# EAGLE design mLRS-tx-dualE22-top-v042 (EAGLE 7.5.0)
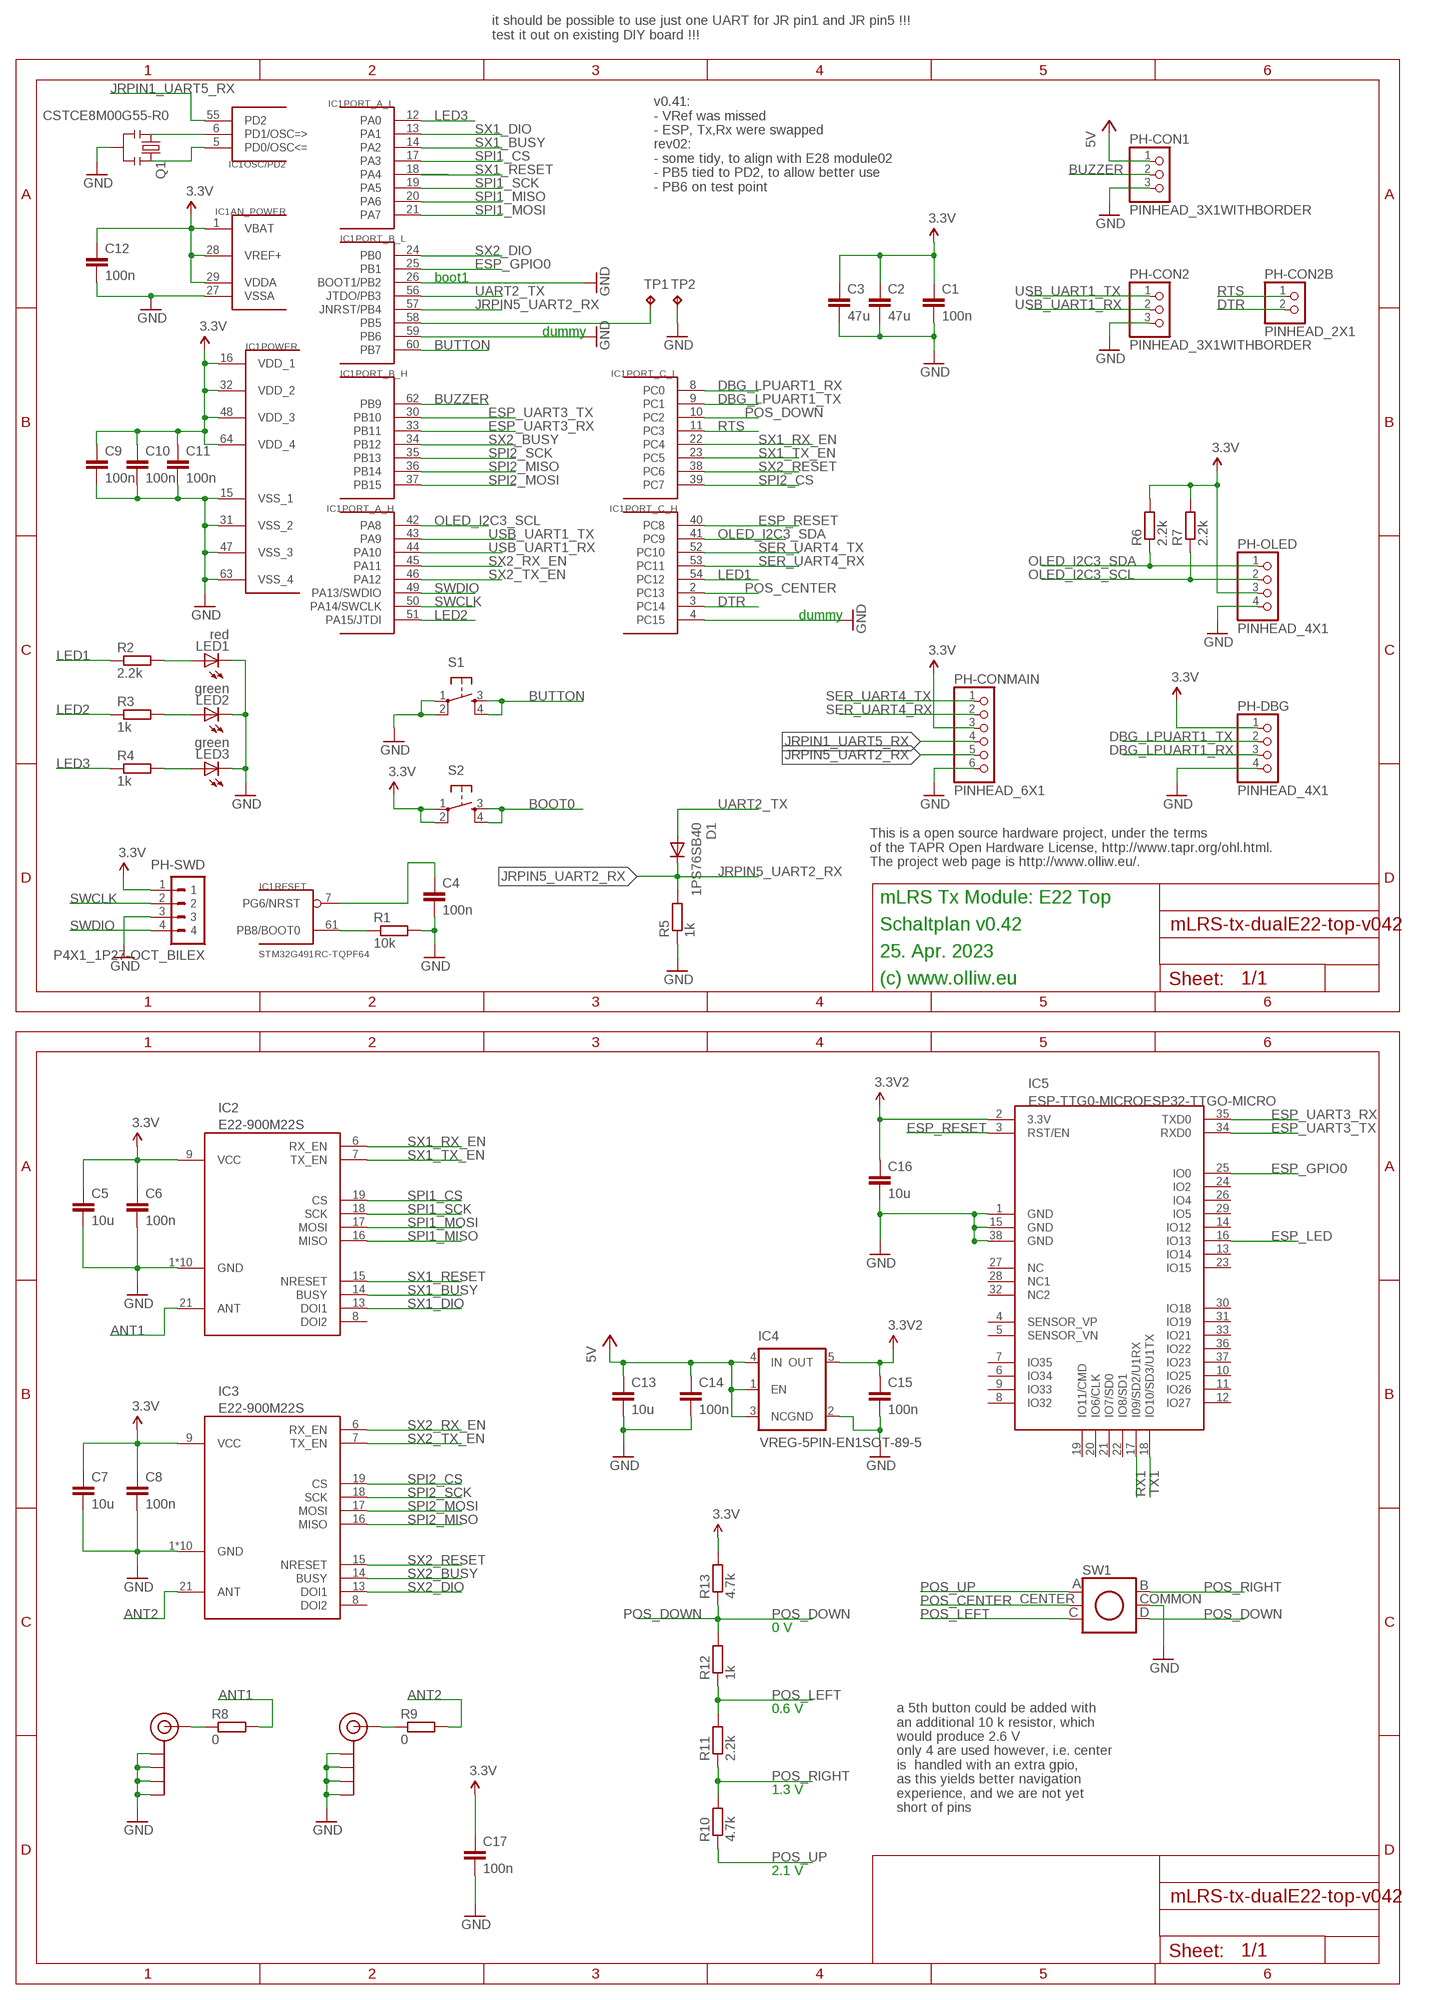
[diagram p0: schematic, sheet 1]

## Parts
C1  100n  C-EUC0402  [C0402]
C2  47u  C-EUC1210  [C1210]
C3  47u  C-EUC1206K  [C1206K]
C4  100n  C-EUC0402  [C0402]
C5  10u  C-EUC0603  [C0603]
C6  100n  C-EUC0402  [C0402]
C7  10u  C-EUC0603  [C0603]
C8  100n  C-EUC0402  [C0402]
C9  100n  C-EUC0402  [C0402]
C10  100n  C-EUC0402  [C0402]
C11  100n  C-EUC0402  [C0402]
C12  100n  C-EUC0402  [C0402]
C13  10u  C-EUC0603  [C0603]
C14  100n  C-EUC0402  [C0402]
C15  100n  C-EUC0402  [C0402]
C16  10u  C-EUC0603  [C0603]
C17  100n  C-EUC0402  [C0402]
D1  1PS76SB40  DIODE-SOD110-R  [SOD110-R]
IC1  STM32G491RC-TQPF64  STM32G4X1RX-TQPF64  [TQFP64]
IC2  E22-900M22S  [E22-900M22S]
IC3  E22-900M22S  [E22-900M22S]
IC4  VREG-5PIN-EN1SOT-89-5  [SOT-89-5]
IC5  ESP-TTG0-MICROESP32-TTGO-MICRO  [ESP32-TTGO-MICRO]
LED1  red  LEDCHIPLED_0603  [CHIPLED_0603]
LED2  green  LEDCHIPLED_0603  [CHIPLED_0603]
LED3  green  LEDCHIPLED_0603  [CHIPLED_0603]
PH-CON1  PINHEAD_3X1WITHBORDER  [PINHEAD_3X1]
PH-CON2  PINHEAD_3X1WITHBORDER  [PINHEAD_3X1]
PH-CON2B  PINHEAD_2X1  [PINHEAD_2X1]
PH-CONMAIN  PINHEAD_6X1  [PINHEAD_6X1]
PH-DBG  PINHEAD_4X1  [PINHEAD_4X1]
PH-OLED  PINHEAD_4X1  [PINHEAD_4X1]
PH-SWD  P4X1_1P27-OCT_BILEX  [4X1_1P27_OCT_BILEX]
Q1  CSTCE8M00G55-R0  RESONATORSMD  [RESONATOR-SMD]
R1  10k  R-EU_R0402  [R0402]
R2  2.2k  R-EU_R0402  [R0402]
R3  1k  R-EU_R0402  [R0402]
R4  1k  R-EU_R0402  [R0402]
R5  1k  R-EU_R0402  [R0402]
R6  2.2k  R-EU_R0402  [R0402]
R7  2.2k  R-EU_R0402  [R0402]
R8  0  R-EU_R0402  [R0402]
R9  0  R-EU_R0402  [R0402]
R10  4.7k  R-EU_R0402  [R0402]
R11  2.2k  R-EU_R0402  [R0402]
R12  1k  R-EU_R0402  [R0402]
R13  4.7k  R-EU_R0402  [R0402]
RF1  SMA_EDGE  [SMA-EDGE]
RF2  SMA_EDGE  [SMA-EDGE]
S1  TAC_SWITCHPTH  [TACTILE-PTH]
S2  TAC_SWITCHPTH  [TACTILE-PTH]
SW1  JOYSTICK-5WAY  [JOYSTICK-5WAY]
TP1  TPB1,27  [B1,27]
TP2  TPB1,27  [B1,27]

## Nets
2.8V: C15.1 C16.1 IC4.5(OUT) IC5.2(3.3V) ; supply symbol labelled 3.3V2
3.3V: C1.1 C2.1 C3.1 C5.1 C6.1 C7.1 C8.1 C9.1 C10.1 C11.1 C12.1 C17.1 IC1.1(AN_POWER:VBAT) IC1.16(POWER:VDD_1) IC1.28(AN_POWER:VREF+) IC1.29(AN_POWER:VDDA) IC1.32(POWER:VDD_2) IC1.48(POWER:VDD_3) IC1.64(POWER:VDD_4) IC2.9(VCC) IC3.9(VCC) PH-CONMAIN.3 PH-DBG.1 PH-OLED.3 PH-SWD.1 R6.2 R7.2 R13.2 S2.1 S2.2
5V: C13.1 C14.1 IC4.1(EN) IC4.3(NC) IC4.4(IN) PH-CON1.1
ANT1: IC2.21(ANT) R8.2
ANT2: IC3.21(ANT) R9.2
BOOT0: IC1.61(RESET:PB8/BOOT0) R1.1 S2.3 S2.4
BUTTON: IC1.60(PORT_B_L:PB7) S1.3 S1.4
BUZZER: IC1.62(PORT_B_H:PB9) PH-CON1.2
DBG_LPUART1_RX: IC1.8(PORT_C_L:PC0) PH-DBG.3
DBG_LPUART1_TX: IC1.9(PORT_C_L:PC1) PH-DBG.2
DTR: IC1.3(PORT_C_H:PC14) PH-CON2B.2
ESP_GPIO0: IC1.25(PORT_B_L:PB1) IC5.25(IO0)
ESP_LED: IC5.16(IO13)
ESP_RESET: IC1.40(PORT_C_H:PC8) IC5.3(RST/EN)
ESP_UART3_RX: IC1.33(PORT_B_H:PB11) IC5.35(TXD0)
ESP_UART3_TX: IC1.30(PORT_B_H:PB10) IC5.34(RXD0)
GND: C1.2 C2.2 C3.2 C4.2 C5.2 C6.2 C7.2 C8.2 C9.2 C10.2 C11.2 C12.2 C13.2 C14.2 C15.2 C16.2 C17.2 IC1.4(PORT_C_H:PC15) IC1.15(POWER:VSS_1) IC1.26(PORT_B_L:BOOT1/PB2) IC1.27(AN_POWER:VSSA) IC1.31(POWER:VSS_2) IC1.47(POWER:VSS_3) IC1.59(PORT_B_L:PB6) IC1.63(POWER:VSS_4) IC2.1(GND) IC2.2(GND) IC2.3(GND) IC2.4(GND) IC2.5(GND) IC2.10(GND) IC2.11(GND) IC2.12(GND) IC2.20(GND) IC2.22(GND) IC3.1(GND) IC3.2(GND) IC3.3(GND) IC3.4(GND) IC3.5(GND) IC3.10(GND) IC3.11(GND) IC3.12(GND) IC3.20(GND) IC3.22(GND) IC4.2(GND) IC5.1(GND) IC5.15(GND) IC5.38(GND) LED1.C LED2.C LED3.C PH-CON1.3 PH-CON2.3 PH-CONMAIN.6 PH-DBG.4 PH-OLED.4 PH-SWD.3 Q1.2 R1.2 R5.1 RF1.GND@0(GND) RF1.GND@1(GND) RF1.GND@2(GND) RF1.GND@3(GND) RF2.GND@0(GND) RF2.GND@1(GND) RF2.GND@2(GND) RF2.GND@3(GND) S1.1 S1.2 SW1.5(COMMON) TP2.TP
JRPIN1_UART5_RX: IC1.55(OSC/PD2:PD2) PH-CONMAIN.4
JRPIN5_UART2_RX: D1.C IC1.57(PORT_B_L:JNRST/PB4) PH-CONMAIN.5 R5.2
LED1: IC1.54(PORT_C_H:PC12) R2.1
LED2: IC1.51(PORT_A_H:PA15/JTDI) R3.1
LED3: IC1.12(PORT_A_L:PA0) R4.1
N$1: R8.1 RF1.SIG(SIGNAL)
N$2: R9.1 RF2.SIG(SIGNAL)
N$3: IC1.58(PORT_B_L:PB5) TP1.TP
N$4: LED1.A R2.2
N$5: C4.1 IC1.7(RESET:PG6/NRST)
N$8: LED2.A R3.2
N$9: LED3.A R4.2
N$12: IC1.5(OSC/PD2:PD0/OSC<=) Q1.3
N$14: IC1.6(OSC/PD2:PD1/OSC=>) Q1.1
OLED_I2C3_SCL: IC1.42(PORT_A_H:PA8) PH-OLED.2 R7.1
OLED_I2C3_SDA: IC1.41(PORT_C_H:PC9) PH-OLED.1 R6.1
POS_CENTER: IC1.2(PORT_C_H:PC13) SW1.2(CENTER)
POS_DOWN: IC1.10(PORT_C_L:PC2) R12.2 R13.1 SW1.6(D)
POS_LEFT: R11.2 R12.1 SW1.3(C)
POS_RIGHT: R10.2 R11.1 SW1.4(B)
POS_UP: R10.1 SW1.1(A)
RTS: IC1.11(PORT_C_L:PC3) PH-CON2B.1
RX1: IC5.17(I09/SD2/U1RX)
SER_UART4_RX: IC1.53(PORT_C_H:PC11) PH-CONMAIN.2
SER_UART4_TX: IC1.52(PORT_C_H:PC10) PH-CONMAIN.1
SPI1_CS: IC1.17(PORT_A_L:PA3) IC2.19(CS)
SPI1_MISO: IC1.20(PORT_A_L:PA6) IC2.16(MISO)
SPI1_MOSI: IC1.21(PORT_A_L:PA7) IC2.17(MOSI)
SPI1_SCK: IC1.19(PORT_A_L:PA5) IC2.18(SCK)
SPI2_CS: IC1.39(PORT_C_L:PC7) IC3.19(CS)
SPI2_MISO: IC1.36(PORT_B_H:PB14) IC3.16(MISO)
SPI2_MOSI: IC1.37(PORT_B_H:PB15) IC3.17(MOSI)
SPI2_SCK: IC1.35(PORT_B_H:PB13) IC3.18(SCK)
SWCLK: IC1.50(PORT_A_H:PA14/SWCLK) PH-SWD.2
SWDIO: IC1.49(PORT_A_H:PA13/SWDIO) PH-SWD.4
SX1_BUSY: IC1.14(PORT_A_L:PA2) IC2.14(BUSY)
SX1_DIO: IC1.13(PORT_A_L:PA1) IC2.13(DOI1)
SX1_RESET: IC1.18(PORT_A_L:PA4) IC2.15(NRESET)
SX1_RX_EN: IC1.22(PORT_C_L:PC4) IC2.6(RX_EN)
SX1_TX_EN: IC1.23(PORT_C_L:PC5) IC2.7(TX_EN)
SX2_BUSY: IC1.34(PORT_B_H:PB12) IC3.14(BUSY)
SX2_DIO: IC1.24(PORT_B_L:PB0) IC3.13(DOI1)
SX2_RESET: IC1.38(PORT_C_L:PC6) IC3.15(NRESET)
SX2_RX_EN: IC1.45(PORT_A_H:PA11) IC3.6(RX_EN)
SX2_TX_EN: IC1.46(PORT_A_H:PA12) IC3.7(TX_EN)
TX1: IC5.18(IO10/SD3/U1TX)
UART2_TX: D1.A IC1.56(PORT_B_L:JTDO/PB3)
USB_UART1_RX: IC1.44(PORT_A_H:PA10) PH-CON2.2
USB_UART1_TX: IC1.43(PORT_A_H:PA9) PH-CON2.1
Unconnected: IC2.8(DOI2) IC3.8(DOI2) IC5.4(SENSOR_VP) IC5.5(SENSOR_VN) IC5.6(IO34) IC5.7(IO35) IC5.8(IO32) IC5.9(IO33) IC5.10(IO25) IC5.11(IO26) IC5.12(IO27) IC5.13(IO14) IC5.14(IO12) IC5.19(IO11/CMD) IC5.20(IO6/CLK) IC5.21(IO7/SD0) IC5.22(IO8/SD1) IC5.23(IO15) IC5.24(IO2) IC5.26(IO4) IC5.27(NC) IC5.28(NC1) IC5.29(IO5) IC5.30(IO18) IC5.31(IO19) IC5.32(NC2) IC5.33(IO21) IC5.36(IO22) IC5.37(IO23)

## Notes on the sheet
- it should be possible to use just one UART for JR pin1 and JR pin5 !!!
  test it out on existing DIY board !!!
- v0.41:
  - VRef was missed
  - ESP, Tx,Rx were swapped
  rev02:
  - some tidy, to align with E28 module02
  - PB5 tied to PD2, to allow better use
  - PB6 on test point
- boot1
- dummy
- dummy
- This is a open source hardware project, under the terms
  of the TAPR Open Hardware License, http://www.tapr.org/ohl.html.
  The project web page is http://www.olliw.eu/.
- mLRS Tx Module: E22 Top
- Schaltplan v0.42
- 25. Apr. 2023
- (c) www.olliw.eu
- 0 V
- a 5th button could be added with
  an additional 10 k resistor, which
  would produce 2.6 V
  only 4 are used however, i.e. center
  is  handled with an extra gpio,
  as this yields better navigation
  experience, and we are not yet
  short of pins
- 0.6 V
- 1.3 V
- 2.1 V

## Library data of the parts
C1-C17 = rcl:C-EU: CAPACITOR, European symbol
D1 = diode:DIODE-: DIODE
IC1 = # stm32:STM32G4X1RX
IC2 IC3 = # stdlib:E22-900M22S
IC4 = # stdlib:VREG-5PIN-EN1
IC5 = # stdlib:ESP-TTG0-MICRO
LED1-LED3 = led:LED: LED OSRAM: - CHIPLED LG R971, LG N971, LY N971, LG Q971, LY Q971, LO R971, LY R971 LH N974, LH R974 LS Q976, LO Q976, LY Q976 LO Q996 - Hyper CHIPLED LW Q18S LB Q993, LB Q99A, LB R99A - SideLED LS A670, LO A670, LY A670, LG A670, LP A670 LB A673, LV A673, LT A673, LW A673 LH A674 LY A675 LS A676, LA A676, LO A676, LY A676, LW A676 LS A679, LY A679, LG A679 - Hyper Micro SIDELED® LS Y876, LA Y876, LO Y876, LY Y876 LT Y87S - SmartLED LW L88C, LW L88S LB L89C, LB L89S, LG L890 LS L89K, LO L89K, LY L89K LS L896, LA L896, LO L896, LY L896 - TOPLED LS T670, LO T670, LY T670, LG T670, LP T670 LSG T670, LSP T670, LSY T670, LOP T670, LYG T670 LG T671, LOG T671, LSG T671 LB T673, LV T673, LT T673, LW T673 LH T674 LS T676, LA T676, LO T676, LY T676, LB T676, LH T676, LSB T676, LW T676 LB T67C, LV T67C, LT T67C, LS T67K, LO T67K, LY T67K, LW E67C LS E67B, LA E67B, LO E67B, LY E67B, LB E67C, LV E67C, LT E67C LW T67C LS T679, LY T679, LG T679 LS T770, LO T770, LY T770, LG T770, LP T770 LB T773, LV T773, LT T773, LW T773 LH T774 LS E675, LA E675, LY E675, LS T675 LS T776, LA T776, LO T776, LY T776, LB T776 LHGB T686 LT T68C, LB T68C - Hyper Mini TOPLED® LB M676 - Mini TOPLED Santana® LG M470 LS M47K, LO M47K, LY M47K Source: http://www.osram.convergy.de LUXEON: - LUMILED® LXK2-PW12-R00, LXK2-PW12-S00, LXK2-PW14-U00, LXK2-PW14-V00 LXK2-PM12-R00, LXK2-PM12-S00, LXK2-PM14-U00 LXK2-PE12-Q00, LXK2-PE12-R00, LXK2-PE12-S00, LXK2-PE14-T00, LXK2-PE14-U00 LXK2-PB12-K00, LXK2-PB12-L00, LXK2-PB12-M00, LXK2-PB14-N00, LXK2-PB14-P00, LXK2-PB14-Q00 LXK2-PR12-L00, LXK2-PR12-M00, LXK2-PR14-Q00, LXK2-PR14-R00 LXK2-PD12-Q00, LXK2-PD12-R00, LXK2-PD12-S00 LXK2-PH12-R00, LXK2-PH12-S00 LXK2-PL12-P00, LXK2-PL12-Q00, LXK2-PL12-R00 Source: www.luxeon.com KINGBRIGHT: KA-3528ASYC Source: www.kingbright.com
PH-CON1 PH-CON2 = # stdlib:PINHEAD_3X1
PH-CON2B = # stdlib:PINHEAD_2X1
PH-CONMAIN = # stdlib:PINHEAD_6X1
PH-DBG PH-OLED = # stdlib:PINHEAD_4X1
PH-SWD = # stdlib:P4X1_1P27
Q1 = # SparkFun2:RESONATOR: Resonator Small SMD resonator. This is the itty bitty 10/20MHz resonators with built in caps. CSTCE10M0G55 and CSTCE20M0V53. Footprint has been reviewed closely but hasn't been tested yet.
R1-R13 = rcl:R-EU_: RESISTOR, European symbol
RF1 RF2 = # SparkFun2:SMA_EDGE: SMA Antenna Connector End launch SMA connector. The paste layer has been removed so that the connector can be hand soldered onto the board after reflow.
S1 S2 = # SparkFun2:TAC_SWITCH: Momentary Switch Button commonly used for reset or general input. Spark Fun Electronics SKU : COM-00097
SW1 = # stdlib:JOYSTICK-5WAY
TP1 TP2 = testpad:TP: Test pad

## Board
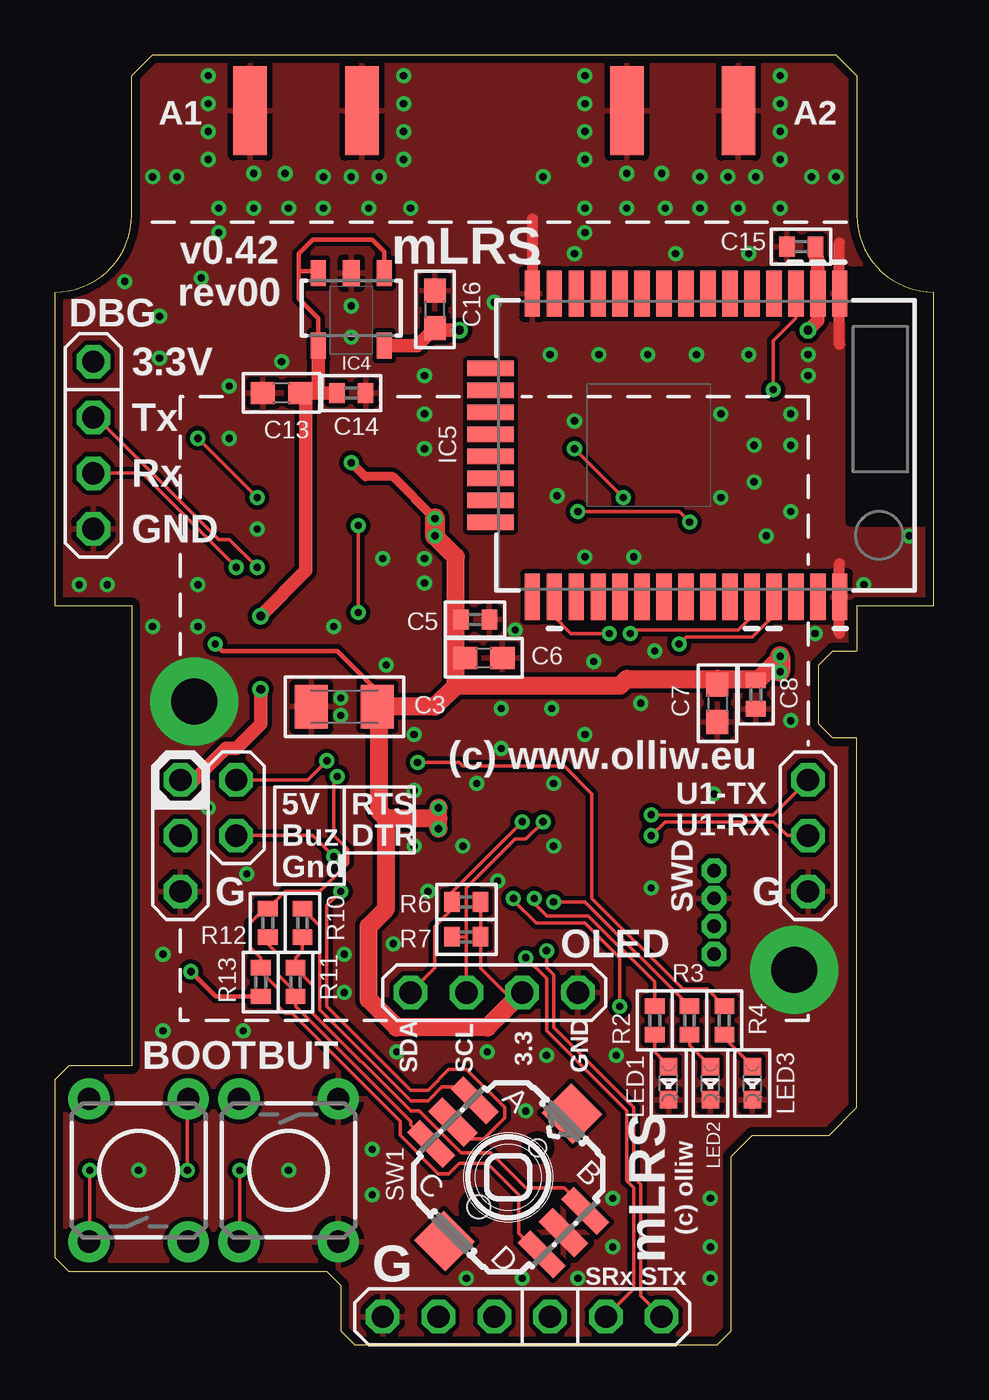
[diagram p1: board, top side]
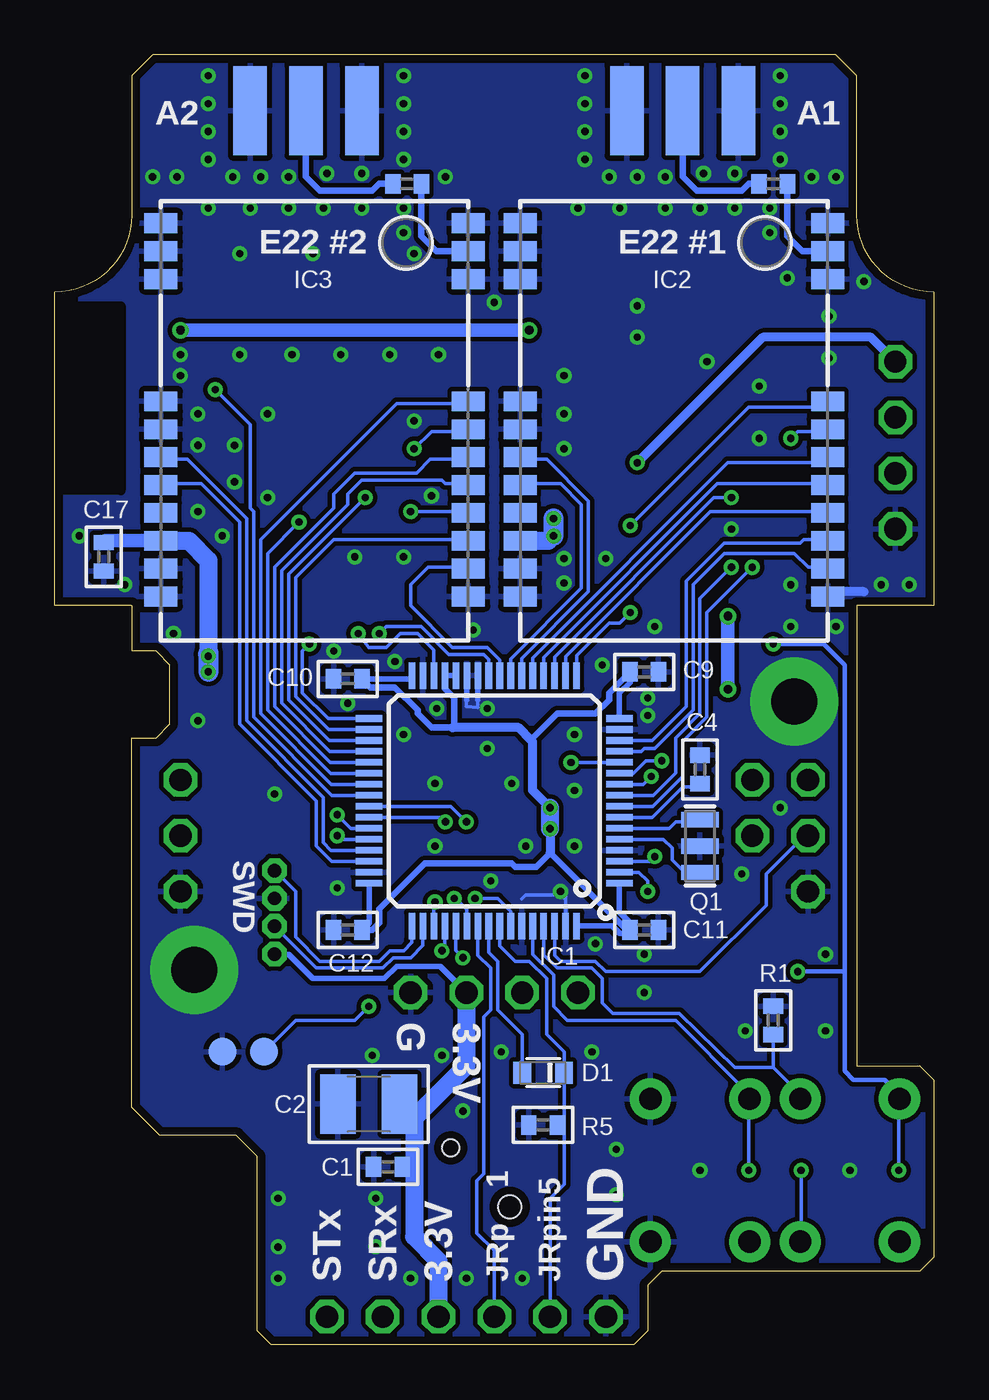
[diagram p2: board, bottom side, seen from below]

Size 40.01 x 58.74 mm. Coordinates in mm from the lower left corner, seen from the top.
Outline: 36.51,10.79 36.51,27.62 35.4,27.62 34.77,28.26 34.77,30.96 35.4,31.59 36.51,31.59 36.51,33.66 40.01,33.66 40.01,47.94 arc-90 36.51,51.44 36.51,57.78 35.56,58.74 4.45,58.74 3.49,57.78 3.49,51.44 arc-90 0,47.94 0,33.66 3.49,33.66 3.49,12.7 0.64,12.7 0,12.07 0,3.97 0.64,3.33 12.38,3.33 13.02,2.7 13.02,0.63 13.65,0 30.16,0 30.8,0.63 30.8,8.57 31.75,9.53 35.24,9.53 36.51,10.79
Copper layers (1*16): Top 0.0356mm / dielectric 1.5011mm / Bottom 0.0356mm
Design rules "ow-oshpark-2layer": minimum track width 6mil, minimum drill 13mil, track to track 6mil, track to pad 6mil, pad to pad 6mil, via to via 6mil, smd to smd 6mil, copper to edge 15mil, drill to drill 6mil, minimum pad ring 7mil, minimum via ring 7mil, stop-mask expansion 2.5mil, vias tented up to drill 26mil, thermal gap 10mil
tRestrict: area 36.2,37.5 to 40.6,48.9
bRestrict: area 37,38.9 to 40.6,47.3

### Footprints (pad centres in the part's own frame; a part is rotated, then mirrored left to right if it is on the bottom)
C0402 = smd 0.7 x 0.9: 1 -0.65,0; 2 0.65,0
C1210 = smd 1.6 x 2.7: 1 -1.4,0; 2 1.4,0
C1206K = smd 1.5 x 2: 1 -1.5,0; 2 1.5,0
C0603 = smd 1.1 x 1: 1 -0.85,0; 2 0.85,0
SOD110-R = smd 0.8 x 1: A 0.95,0; C -0.95,0
TQFP64 = smd 1.2 x 0.3: 1 -5.7,3.75; 2 -5.7,3.25; 3 -5.7,2.75; 4 -5.7,2.25; 5 -5.7,1.75; 6 -5.7,1.25; 7 -5.7,0.75; 8 -5.7,0.25; 9 -5.7,-0.25; 10 -5.7,-0.75; 11 -5.7,-1.25; 12 -5.7,-1.75; 13 -5.7,-2.25; 14 -5.7,-2.75; 15 -5.7,-3.25; 16 -5.7,-3.75; 33 5.7,-3.75; 34 5.7,-3.25; 35 5.7,-2.75; 36 5.7,-2.25; 37 5.7,-1.75; 38 5.7,-1.25; 39 5.7,-0.75; 40 5.7,-0.25; 41 5.7,0.25; 42 5.7,0.75; 43 5.7,1.25; 44 5.7,1.75; 45 5.7,2.25; 46 5.7,2.75; 47 5.7,3.25; 48 5.7,3.75 | smd 0.3 x 1.2: 17 -3.75,-5.7; 18 -3.25,-5.7; 19 -2.75,-5.7; 20 -2.25,-5.7; 21 -1.75,-5.7; 22 -1.25,-5.7; 23 -0.75,-5.7; 24 -0.25,-5.7; 25 0.25,-5.7; 26 0.75,-5.7; 27 1.25,-5.7; 28 1.75,-5.7; 29 2.25,-5.7; 30 2.75,-5.7; 31 3.25,-5.7; 32 3.75,-5.7; 49 3.75,5.7; 50 3.25,5.7; 51 2.75,5.7; 52 2.25,5.7; 53 1.75,5.7; 54 1.25,5.7; 55 0.75,5.7; 56 0.25,5.7; 57 -0.25,5.7; 58 -0.75,5.7; 59 -1.25,5.7; 60 -1.75,5.7; 61 -2.25,5.7; 62 -2.75,5.7; 63 -3.25,5.7; 64 -3.75,5.7
E22-900M22S = smd 1.5 x 0.9: 1 -7,9; 2 -7,7.73; 3 -7,6.46; 4 -7,0.89; 5 -7,-0.38; 6 -7,-1.65; 7 -7,-2.92; 8 -7,-4.19; 9 -7,-5.46; 10 -7,-6.73; 11 -7,-8; 12 7,-8; 13 7,-6.73; 14 7,-5.46; 15 7,-4.19; 16 7,-2.92; 17 7,-1.65; 18 7,-0.38; 19 7,0.89; 20 7,6.46; 21 7,7.73; 22 7,9
SOT-89-5 = smd 0.68 x 1.2: 1 -1.5,-1.65; 3 1.5,-1.65; 4 1.5,1.65; 5 -1.5,1.65 | smd 0.76 x 1.2: 2 0,-1.65
ESP32-TTGO-MICRO = smd 2.1 x 0.7: 1 -6.9,7; 2 -6.9,6; 3 -6.9,5; 4 -6.9,4; 5 -6.9,3; 6 -6.9,2; 7 -6.9,1; 8 -6.9,0; 9 -6.9,-1; 10 -6.9,-2; 11 -6.9,-3; 12 -6.9,-4; 13 -6.9,-5; 14 -6.9,-6; 15 -6.9,-7; 24 6.9,-7; 25 6.9,-6; 26 6.9,-5; 27 6.9,-4; 28 6.9,-3; 29 6.9,-2; 30 6.9,-1; 31 6.9,0; 32 6.9,1; 33 6.9,2; 34 6.9,3; 35 6.9,4; 36 6.9,5; 37 6.9,6; 38 6.9,7 | smd 0.7 x 2.1: 16 -3.5,-8.9; 17 -2.5,-8.9; 18 -1.5,-8.9; 19 -0.5,-8.9; 20 0.5,-8.9; 21 1.5,-8.9; 22 2.5,-8.9; 23 3.5,-8.9
CHIPLED_0603 = smd 0.8 x 0.8: A 0,-0.75; C 0,0.75
PINHEAD_3X1 = drill 1.016 octagon: 1 0,0; 2 0,-2.54; 3 0,-5.08
PINHEAD_2X1 = drill 1.016 octagon: 1 0,0; 2 0,-2.54
PINHEAD_6X1 = drill 1.016 octagon: 1 0,12.7; 2 0,10.16; 3 0,7.62; 4 0,5.08; 5 0,2.54; 6 0,0
PINHEAD_4X1 = drill 1.016 octagon: 1 0,7.62; 2 0,5.08; 3 0,2.54; 4 0,0
4X1_1P27_OCT_BILEX = drill 0.61 pad 1.118 octagon: 1 0,0; 2 0,-1.27; 3 0,-2.54; 4 0,-3.81
RESONATOR-SMD = smd 0.7 x 1.7: 1 -1.2,0; 2 0,0; 3 1.2,0
R0402 = smd 0.7 x 0.9: 1 -0.65,0; 2 0.65,0
SMA-EDGE = smd 1.524 x 4.064: GND@0 0,0; GND@1 5.08,0; SIG 2.54,0 | smd 1.524 x 4.064 bottom: GND@2 0,0; GND@3 5.08,0
TACTILE-PTH = drill 1.016 pad 1.88: 1 -3.251,2.261; 2 3.251,2.261; 3 -3.251,-2.261; 4 3.251,-2.261
JOYSTICK-5WAY = smd 2.286 x 0.813: 1 -3.556,1.4; 3 -3.556,-1.4; 4 3.556,1.4; 6 3.556,-1.4 | smd 2.286 x 0.914: 2 -3.556,0; 5 3.556,0 | smd 2 x 1.9: S 0,4.1; T 0,-4.1 | hole 0.75: 0,1.9 | hole 1.05: 0,-1.9
B1,27 = smd 1.27 x 1.27: TP 0,0

### Placement (x,y rotation side)
C1  24.84,8.1 180 bottom
C2  25.72,10.95 180 bottom
C3  13.18,29.05 180 top
C4  10.64,26.19 90 bottom
C5  19.53,31.27 0 top
C6  19.13,33.02 0 top
C7  30.16,29.21 270 top
C8  31.91,29.61 270 top
C9  13.18,30.64 0 bottom
C10  26.67,30.32 180 bottom
C11  13.18,18.89 0 bottom
C12  26.67,18.89 180 bottom
C13  10.32,43.34 180 top
C14  13.49,43.34 0 top
C15  33.97,50.01 180 top
C16  17.3,47.15 90 top
C17  37.78,35.88 270 bottom
D1  17.78,12.38 180 bottom
IC1  20,24.77 180 bottom
IC2  11.83,42.07 0 bottom
IC3  28.18,42.07 0 bottom
IC4  13.49,47.15 180 top
IC5  28.73,40.96 270 top
LED1  27.94,11.91 180 top
LED2  29.84,11.91 180 top
LED3  31.75,11.91 180 top
PH-CON1  5.71,25.72 0 top
PH-CON2  34.29,25.72 0 top
PH-CON2B  8.26,25.72 0 top
PH-CONMAIN  14.92,1.27 270 top
PH-DBG  1.75,37.15 0 top
PH-OLED  23.81,16.03 90 top
PH-SWD  30,17.78 180 top
Q1  10.64,22.7 270 bottom
R1  7.3,14.76 90 bottom
R2  27.3,14.76 270 top
R3  28.89,14.76 270 top
R4  30.48,14.76 270 top
R5  17.78,10 0 bottom
R6  18.73,20.16 0 top
R7  18.73,18.57 0 top
R8  7.3,52.86 0 bottom
R9  23.97,52.86 0 bottom
R10  11.27,19.21 270 top
R11  10.95,16.51 270 top
R12  9.68,19.21 90 top
R13  9.37,16.51 270 top
RF1  13.97,56.2 0 bottom
RF2  31.11,56.2 0 bottom
S1  10.64,7.94 270 top
S2  3.81,7.94 90 top
SW1  20.64,7.62 315 top
TP1  30.48,13.34 0 bottom
TP2  32.39,13.34 0 bottom

### Tracks (layer width: path | path; a pad name or v marks a point on that pad's centre or on a via)
2.8V  (via drill 0.4)
  Top 0.61: v34.29,46.2 34.73,46.64 IC5.2 34.73,49.4 34.61,49.53 34.61,50.15 C15.1 | IC4.5 16.5,45.5 C16.1 17.3,46.2 v18.41,46.2
  Bottom 0.61: v34.29,46.2 v18.41,46.2
3.3V  (via drill 0.33)
  Top 0.152: PH-OLED.3 20.48,16.03 19.38,17.13 R7.2 R6.2 | v1.59,7.94 1.59,4.72 S2.1
  Top 0.203: 14.76,29.69 12.86,31.59 7.62,31.59 v7.3,31.91 | R13.2 7.32,15.86 v6.19,16.99
  Top 0.406: 14.76,29.69 14.76,28.26 | v17.3,37.62 15.4,39.53 14.13,39.53 v13.49,40.16
  Top 0.61: C3.1 14.52,28.8 14.76,28.26 | C7.1 30.16,30.32 | C8.1 32.07,30.32 | C6.1 18.26,32.7 | 18.73,31.27 C5.1 18.26,31.27
  Top 0.813: PH-OLED.3 19.68,14.45 15.56,14.45 14.29,15.72 14.29,19.05 15.08,19.84 15.08,23.97 | 15.08,23.97 14.76,24.29 14.76,28.26 14.78,28.73 14.78,28.89 C3.1 17.3,29.05 18.26,30 | 17.46,23.97 v17.46,24.45 | v17.46,23.5 17.46,23.97 | 17.46,23.97 15.08,23.97 | 33.02,31.27 32.07,30.32 30.16,30.32 C10.1 25.72,30 18.26,30 | 18.26,30 18.26,31.27 18.26,32.7 18.26,35.88 v17.3,36.83
  Top 0.914: v17.3,37.62 v17.3,36.83 | v33.02,31.35 33.02,31.27 v33.02,30.64
  Bottom 0.152: S2.2 1.55,11.15 1.59,11.11 | 1.59,11.11 v1.59,7.94 | 1.59,11.11 1.59,11.43
  Bottom 0.203: 1.59,11.43 2.22,12.07 3.65,12.07 4.05,12.46 4.05,16.99 | 4.05,16.99 4.05,30.96 5,31.91 v7.3,31.91 | v6.19,16.99 4.05,16.99
  Bottom 0.254: IC1.1 14.3,19.7 13.81,19.21 13.81,18.88 C11.1 | IC1.64 14.62,19.07 14.29,18.73 13.81,18.73 13.97,18.89 | IC1.48 25.7,19.21 C12.1 | PH-SWD.1 29.37,17.78 28.26,16.67 25,16.67 24.45,17.22 22.46,17.22 PH-OLED.3 | IC1.32 23.75,30.38 23.81,30.32 25.88,30.32 26,30.46 C10.1 | 21.93,28.13 21.91,28.1 | 13.81,30.64 13.83,30.65 C9.1 13.81,30.78 13.81,30.16 14.3,29.67 IC1.16 | IC1.29 IC1.28
  Bottom 0.305: C9.1 13.97,30.48 14.76,29.69 14.76,29.37 15.4,28.73 17.14,28.73 18.34,27.54 | C10.1 26.18,30.46 25.64,29.92 24.53,29.92 23.49,28.89 23.49,28.73 22.86,28.1 21.91,28.1 | C12.1 25.56,18.89 25.24,19.21 25.24,19.84 23.18,21.91 19.21,21.91 19.05,21.75 18.1,21.75 17.46,22.38 13.97,18.89 C11.1 | IC1.29 22.25,29.87 21.83,29.45 21.83,28.15 21.93,28.13
  Bottom 0.406: v17.46,23.5 17.46,22.38 | v17.46,24.45 18.26,25.24 18.26,27.46 18.34,27.54 18.89,28.1 21.91,28.1 | PH-DBG.1 2.86,45.88 7.78,45.88 v13.49,40.16
  Bottom 0.61: C2.1 23.97,10.95 23.65,10.32 | C1.1 23.65,8.25 | IC3.9 37.7,36.61 C17.1
  Bottom 0.813: PH-OLED.3 21.27,12.7 23.65,10.32 23.65,8.25 23.65,4.92 22.54,3.81 PH-CONMAIN.3 | v17.46,23.5 v17.46,24.45 | IC3.9 33.91,36.61 33.02,35.72 33.02,31.51 | IC2.9 17.52,36.61 v17.3,36.83
  Bottom 0.914: v17.3,36.83 v17.3,37.62 | 33.02,31.51 v33.02,31.35 v33.02,30.64
5V  (via drill 0.4)
  Top 0.203: IC4.1 14.99,49.78 14.45,50.32 11.75,50.32 11.11,49.69 11.11,48.9 | IC4.4 11.99,46.74 11.11,47.62 11.11,48.9 | IC4.3 11.99,48.81 11.91,48.9 11.11,48.9
  Top 0.61: v9.37,29.84 9.37,28.26 8.26,27.15 7.78,27.15 6.35,25.72 PH-CON1.1 | v9.37,33.18 11.43,35.24 11.43,43.28 C13.1 12.06,43.34 | 12.06,43.34 C14.1 | IC4.4 11.99,43.41 12.06,43.34
  Bottom 0.61: v9.37,29.84 v9.37,33.18
ANT1
  Bottom 0.305: IC2.21 5.98,49.8 6.67,50.48 6.67,52.72 R8.2
ANT2
  Bottom 0.305: IC3.21 22.65,49.8 23.34,50.48 23.34,52.85 R9.2
BOOT0  (via drill 0.33)
  Top 0.152: S2.4 6.07,11.15 6.03,11.11 v6.03,7.94
  Bottom 0.152: IC1.61 17.75,17.75 17.14,17.14 15.56,17.14 15.08,16.67 15.08,15.56 14.61,15.08 11.59,15.08 9.05,12.62 7.3,12.62 | v6.03,7.94 6.03,4.72 S2.3 | 7.3,12.62 R1.1 | S2.4 6.07,11.39 7.3,12.62
BUTTON  (via drill 0.33)
  Top 0.152: v8.41,7.94 8.41,4.72 S1.4
  Bottom 0.152: IC1.60 18.25,17.78 17.3,16.83 17.3,15.4 16.67,14.76 11.75,14.76 8.57,11.59 8.57,11.39 S1.3 8.38,11.15 8.41,11.11 v8.41,7.94
BUZZER
  Bottom 0.152: IC1.62 17.25,17.73 16.99,17.46 15.4,17.46 14.92,16.99 10.64,16.99 7.62,20 7.62,21.43 5.87,23.18 PH-CON1.2
DBG_LPUART1_RX  (via drill 0.33)
  Top 0.152: PH-DBG.3 3.97,39.69 v8.26,35.4
  Bottom 0.152: v8.26,35.4 10.32,33.34 10.32,28.58 11.43,27.46 11.43,25.88 12.79,24.52 IC1.8
DBG_LPUART1_TX  (via drill 0.33)
  Top 0.152: v9.21,35.4 7.94,36.67 7.46,36.67 1.91,42.23 PH-DBG.2
  Bottom 0.152: v9.21,35.4 10.64,33.97 10.64,28.73 11.75,27.62 11.75,26.04 12.77,25.02 IC1.9
DTR  (via drill 0.33)
  Top 0.152: PH-CON2B.2 11.75,23.18 v12.7,22.23
  Bottom 0.152: IC1.3 12.91,22.02 v12.7,22.23
ESP_GPIO0  (via drill 0.33)
  Top 0.152: v25.24,32.38 23.49,32.38 22.7,33.18 22.7,34.18 IC5.25
  Bottom 0.152: v25.24,32.38 24.92,32.7 23.34,32.7 22.07,31.43 20.48,31.43 20.25,31.21 IC1.25
ESP_RESET  (via drill 0.33)
  Top 0.152: v32.7,43.5 32.7,45.72 33.73,46.75 IC5.3
  Bottom 0.152: v32.7,43.5 31.11,41.91 31.11,38.1 30.96,37.94 30.96,28.58 27.4,25.02 IC1.40
ESP_UART3_RX  (via drill 0.33)
  Top 0.152: IC5.35 32.73,33.21 31.75,32.23 28.73,32.23 v28.42,31.91
  Bottom 0.152: v28.42,31.91 28.73,31.59 28.73,29.69 27.56,28.52 IC1.33
ESP_UART3_TX  (via drill 0.33)
  Top 0.152: IC5.34 31.73,33.16 31.11,32.54 26.35,32.54 v26.19,32.38
  Bottom 0.152: IC1.30 22.75,31.64 23.49,32.38 24.29,32.38 24.92,31.75 25.72,31.75 v26.19,32.38
GND  (via drill 0.33, 2.1 pad 4)
  Top 0.508: 35.72,32.38 35.72,35.56 | 35.72,45.56 35.72,50.16 | 21.75,47.94 21.75,51.28
  Bottom 0.152: v16.99,20.64 16.75,20.4 16.75,20 | IC1.26 20.75,29.01 21.27,29.05 21.27,29.23 21.26,30.8 | IC1.63 16.75,20.25 16.99,20.48 18.57,20.48 18.75,20.3
  Bottom 0.254: 20.75,30.8 20.75,29.37 | 21.26,30.8 21.26,29.37
  Bottom 0.406: 3.17,34.29 5.08,34.29
  other vias: 33.66,17.07 6.35,29.29 9.05,51.75 10.64,51.75 12.22,51.75 14.29,51.75 16.19,51.75 6.99,57.78 6.99,56.52 6.99,55.24 6.99,53.98 5.56,53.18 9.05,53.34 13.49,53.18 14.76,53.18 15.88,53.98 15.88,57.78 15.88,56.52 15.88,55.24 10.48,53.34 12.22,53.18 24.13,57.78 24.13,56.52 24.13,55.24 24.13,53.98 26.04,53.34 27.62,53.34 29.37,53.18 30.64,53.18 31.91,53.18 33.02,57.78 33.02,56.52 33.02,55.24 33.02,53.98 28.26,49.69 23.65,49.69 24.13,50.64 31.59,49.69 31.59,45.09 4.76,46.83 4.76,44.93 2.38,34.61 1.11,34.61 24.13,27.78 19.21,25.56 18.57,22.7 16.35,22.7 16.35,27.78 15.08,30.96 13.02,28.65 6.99,24.45 8.73,21.43 15.4,18.26 13.18,17.78 26.67,29.21 27.15,20.8 22.38,13.18 15.56,13.34 19.68,13.34 25.56,13.18 8.57,14.29 20.32,28.97 16.35,25.24 22.7,22.7 30,25.08 10.64,7.94 3.81,7.94 29.84,3.02 29.84,4.45 29.84,6.67 14.45,6.83 23.81,3.02 25.4,4.45 25.4,6.67 16.83,35.8 20.95,32.54 27.3,31.59 4.45,32.7 6.51,34.61 24.53,31.12 22.7,25.56 20.16,21.11 12.7,32.7 33.5,28.42 21.27,3.02 18.73,3.02 13.18,16.03 21.43,10.64 14.45,8.89 4.92,17.78 4.92,14.29 34.61,32.38 22.86,38.66 23.65,42.07 33.5,42.39 33.5,37.94 31.83,40.96 9.21,37.15 30.32,38.58 30.32,42.39 22.54,45.09 24.76,45.09 26.99,45.09 29.21,45.09 7.46,51.75 3.17,48.42 6.67,48.58 26.04,51.75 27.78,51.75 29.37,51.75 31.11,51.75 33.02,51.75 24.13,51.75 6.51,32.7 34.29,44.13 4.45,53.18 35.56,53.18 34.45,53.18 13.02,29.45 31.83,39.29 33.5,40.96 20,47.47 34.29,45.09 16.83,34.69 13.49,47.31 13.49,45.88 36.83,34.61 38.89,36.83 32.39,36.83 24.13,35.88 26.35,35.88 10.32,44.77 16.83,42.39 16.83,40.8 16.83,44.13 14.92,35.8 7.46,50.64 22.22,53.18 7.94,41.27 20.32,27.15 7.94,43.66 22.62,28.97
  pour Bottom (isolate 0.203, rank 6): -0.64,59.05 40.64,59.05 40.64,-0.32 -0.64,-0.32
  pour Top (isolate 0.203, rank 6): -0.64,59.05 40.64,59.05 40.64,-0.32 -0.64,-0.32
JRPIN1_UART5_RX
  Bottom 0.152: IC1.55 20.75,17.74 20.16,17.14 20.16,15.24 20.48,14.92 20.48,7.78 20.8,7.46 20.8,5.08 20,4.29 PH-CONMAIN.4
JRPIN5_UART2_RX
  Bottom 0.152: IC1.57 19.75,18.16 19.05,17.46 18.41,17.46 17.62,16.67 17.62,14.13 16.83,13.34 16.83,12.23 | 16.83,12.23 D1.C | 16.83,12.23 16.83,9.68 | 16.83,9.68 16.83,7.3 17.46,6.67 PH-CONMAIN.5 | R5.2 16.83,9.68
LED1  (via drill 0.33)
  Top 0.152: R2.1 27.3,16.51 24.29,19.53 22.38,19.53 21.83,20.08 v21.83,20.32
  Bottom 0.152: IC1.54 21.25,19.82 21.75,20.32 v21.83,20.32
LED2  (via drill 0.33)
  Top 0.152: R3.1 28.75,15.4 28.89,15.4 24.13,20.16 v22.7,20.16
  Bottom 0.152: v22.7,20.16 22.75,20.05 IC1.51
LED3  (via drill 0.33)
  Top 0.152: v16.51,26.51 18.41,26.51 18.57,26.35 23.18,26.35 24.45,25.08 24.45,20.32 28.57,16.19 29.7,16.19 R4.1
  Bottom 0.152: IC1.12 15.71,26.52 v16.51,26.51
N$1
  Bottom 0.305: R8.1 8.41,52.86 8.73,52.55 10.79,52.55 11.43,53.18 RF1.SIG
N$2
  Bottom 0.305: R9.1 25.24,52.86 25.56,52.55 27.94,52.55 28.57,53.18 RF2.SIG
N$3  (via drill 0.33)
  Top 0.152: v20.88,20.32 20.88,20.24 21.91,19.21 24.13,19.21 25.72,17.62 v25.72,15.4
  Bottom 0.152: v25.72,15.4 26.35,14.76 29.05,14.76 TP1.TP | IC1.58 19.25,19.73 19.84,20.32 v20.88,20.32
N$4
  Top 0.152: R2.2 27.3,13.34 27.94,12.7 LED1.A
N$5
  Bottom 0.152: IC1.7 12.81,24.02 11.43,25.4 10.3,25.4 C4.1
N$8
  Top 0.152: R3.2 28.91,13.64 29.84,12.7 LED2.A
N$9
  Top 0.152: LED3.A 31.75,12.7 30.48,13.97 R4.2
N$12
  Bottom 0.152: Q1.3 10.25,21.59 11.43,21.59 11.91,22.07 11.91,22.62 12.3,23.02 IC1.5
N$14
  Bottom 0.152: IC1.6 12.04,23.52 11.75,23.81 10.25,23.81 Q1.1
OLED_I2C3_SCL  (via drill 0.33)
  Top 0.152: 18.73,18.57 18.73,20.8 20.95,23.02 21.43,23.02 v22.22,23.81 | 18.73,18.57 PH-OLED.2 | R7.1 18.73,18.57
  Bottom 0.152: IC1.42 22.43,24.02 v22.22,23.81
OLED_I2C3_SDA  (via drill 0.33)
  Top 0.152: v21.27,23.81 18.08,20.62 R6.1 17.94,19.68 17.3,19.05 17.3,17.14 PH-OLED.1
  Bottom 0.152: IC1.41 21.97,24.52 v21.27,23.81
POS_CENTER  (via drill 0.33)
  Top 0.152: SW1.2 | SW1.2 18.89,9.37 19.53,9.37 20.48,10.32 20.48,10.79 18.73,12.54 17.94,12.54 16.99,11.59 16.19,11.59 12.38,15.4 12.38,20 v13.02,20.64
  Bottom 0.152: IC1.2 13.42,21.52 13.02,21.11 v13.02,20.64
POS_DOWN  (via drill 0.33)
  Top 0.152: SW1.6 21.92,4.27 21.11,5.08 21.11,6.83 19.68,8.25 18.41,8.25 17.94,7.78 17.46,7.78 15.72,9.53 15.72,10.16 10.79,15.08 10.48,15.08 10.16,15.4 10.16,16.19 9.37,16.99 R13.1 9.37,17.62 8.89,18.1 8.89,19.21 9.53,19.84 R12.2 9.84,20 10.48,20.64 12.06,20.64 13.34,21.91 13.34,22.54 12.7,23.18 12.7,25.72 v12.86,25.88
  Bottom 0.152: IC1.10 13.22,25.52 v12.86,25.88
POS_LEFT
  Top 0.152: SW1.3 16.83,9.45 16.83,9.53 16.67,9.53 16.19,10 16.19,10.16 10.95,15.4 R11.2 10.95,16.03 10.16,16.83 10.16,17.77 9.68,18.24 R12.1
POS_RIGHT
  Top 0.152: SW1.4 24.14,6.18 23.18,7.14 21.43,7.14 19.84,8.73 18.49,8.73 16.59,10.64 16.19,10.64 11.75,15.08 11.75,16.37 R11.1 10.95,17.62 11.27,17.94 R10.2
POS_UP
  Top 0.152: SW1.1 18.49,11.75 17.62,11.75 16.99,11.11 16.19,11.11 12.06,15.24 12.06,19.07 R10.1
RTS  (via drill 0.33)
  Top 0.152: v12.38,26.59 11.51,25.72 PH-CON2B.1
  Bottom 0.152: v12.38,26.59 13.1,26.59 13.67,26.02 IC1.11
SER_UART4_RX  (via drill 0.33)
  Top 0.152: PH-CONMAIN.2 26.35,2.54 26.35,7.14 26.04,7.46 26.04,10.64 22.38,14.29 22.38,16.67 v21.43,17.62
  Bottom 0.152: IC1.53 21.75,17.94 v21.43,17.62
SER_UART4_TX  (via drill 0.33)
  Top 0.152: PH-CONMAIN.1 26.67,2.22 26.67,7.3 26.35,7.62 26.35,10.79 22.7,14.45 22.7,16.83 22.38,17.14 v22.38,17.94
  Bottom 0.152: IC1.52 22.25,18.07 v22.38,17.94
SPI1_CS  (via drill 0.33)
  Top 0.152: v13.81,33.34 v13.81,37.31
  Bottom 0.152: v13.81,33.34 14.29,32.86 14.76,32.86 16.25,31.37 IC1.17 | v13.81,37.31 8.41,42.7 5,42.7 IC2.19
SPI1_MISO
  Bottom 0.152: IC1.20 17.75,31.3 9.84,39.21 4.69,39.21 IC2.16
SPI1_MOSI
  Bottom 0.152: IC1.21 18.25,31.28 9.37,40.16 5,40.16 IC2.17
SPI1_SCK  (via drill 0.33)
  Top 0.152: v9.21,38.58 v6.51,41.27
  Bottom 0.152: IC1.19 17.25,31.33 10,38.58 v9.21,38.58 | v6.51,41.27 6.19,41.59 4.97,41.59 IC2.18
SPI2_CS
  Bottom 0.152: IC1.39 27.42,25.52 30.64,28.73 30.64,36.67 24.45,42.86 21.04,42.86 IC3.19
SPI2_MISO
  Bottom 0.152: IC1.36 27.49,27.02 29.69,29.21 29.69,35.24 26.67,38.26 26.67,38.73 26.04,39.37 22.38,39.37 22.22,39.21 21.59,39.21 21.53,38.99 IC3.16
SPI2_MOSI
  Bottom 0.152: IC1.37 27.47,26.52 30,29.05 30,35.4 27.3,38.1 27.3,38.73 26.35,39.69 23.54,39.69 22.91,40.32 20.95,40.32 21.1,40.18 IC3.17
SPI2_SCK  (via drill 0.33)
  Top 0.152: v25.88,38.58 v23.65,40.8
  Bottom 0.152: IC1.35 27.51,27.52 29.37,29.37 29.37,35.08 v25.88,38.58 | v23.65,40.8 22.86,41.59 21.16,41.59 IC3.18
SWCLK
  Bottom 0.152: IC1.50 23.25,18.18 23.81,17.62 24.61,17.62 25.08,17.14 28.1,17.14 PH-SWD.2
SWDIO
  Bottom 0.152: IC1.49 23.75,18.32 24.13,17.94 24.76,17.94 25.24,17.46 27.94,17.46 29.05,18.57 29.05,20.64 PH-SWD.4
SX1_BUSY
  Bottom 0.152: IC1.14 12.81,27.52 11.27,29.05 11.27,34.77 9.53,36.51 6.08,36.51 5.92,36.67 4.76,36.67 IC2.14
  Bottom 0.406: IC2.14
SX1_DIO
  Bottom 0.152: IC2.13 5.13,35.4 5.71,35.4 6.35,36.04 9.53,36.04 10.95,34.61 10.95,28.89 12.7,27.15 13.18,27.15 13.31,27.02 IC1.13
SX1_RESET
  Bottom 0.152: IC1.18 16.75,31.35 10.16,37.94 4.84,37.94 IC2.15
SX1_RX_EN
  Bottom 0.152: IC2.6 18.81,40.32 17.62,40.32 15.72,38.42 15.72,34.29 18.75,31.25 IC1.22
SX1_TX_EN
  Bottom 0.152: IC1.23 19.25,31.23 16.03,34.45 16.03,38.26 16.99,39.21 18.81,39.21 IC2.7
SX2_BUSY
  Bottom 0.152: IC1.34 27.54,28.02 29.05,29.53 29.05,34.92 27.3,36.67 21.35,36.67 IC3.14
SX2_DIO
  Bottom 0.152: IC1.24 19.75,31.18 20.32,31.75 21.91,31.75 23.81,33.66 23.81,34.61 23.02,35.4 21.19,35.4 IC3.13
SX2_RESET  (via drill 0.33)
  Top 0.152: v28.89,37.46 28.42,37.94 v23.81,37.94
  Bottom 0.152: IC1.38 27.44,26.02 30.32,28.89 30.32,36.04 v28.89,37.46 | v23.81,37.94 21.32,37.94 IC3.15
SX2_RX_EN
  Bottom 0.152: IC1.45 27.44,22.52 27.78,22.86 27.78,24.92 31.27,28.42 31.27,37.62 33.97,40.32 35.2,40.32 IC3.6
SX2_TX_EN
  Bottom 0.152: IC1.46 27.41,22.02 28.1,22.7 28.1,24.77 31.59,28.26 31.59,37.46 33.34,39.21 35.16,39.21 IC3.7
UART2_TX
  Bottom 0.152: IC1.56 20.25,17.87 19.84,17.46 19.84,15.24 18.73,14.13 D1.A
USB_UART1_RX  (via drill 0.33)
  Top 0.152: v27.15,23.18 27.78,23.81 32.7,23.81 33.34,23.18 PH-CON2.2
  Bottom 0.152: IC1.44 26.98,23.02 v27.15,23.18
USB_UART1_TX  (via drill 0.33)
  Top 0.152: v27.15,24.13 32.7,24.13 PH-CON2.1
  Bottom 0.152: IC1.43 26.53,23.52 v27.15,24.13

### Text on the board
tNames: A1 | A2 | v0.42 / rev00 | mLRS | DBG | 3.3V | Tx | Rx | GND | (c) www.olliw.eu | 5V | RTS | U1-TX | U1-RX | Buz | DTR | Gnd | G | SWD | G | OLED | BOOT | BUT | SDA | SCL | 3.3 | GND | mLRS | (c) olliw | G | SRx | STx
bNames: A1 | A2 | E22 #1 | E22 #2 | SWD | 3.3V | G | 1 | GND | JRpin5 | JRp | 3.3V | SRx | STx